# Altium schematic sheet 智能车驱动板DRV8701E.SchDoc
size A4; SheetNumber: 1; SheetTotal: 1
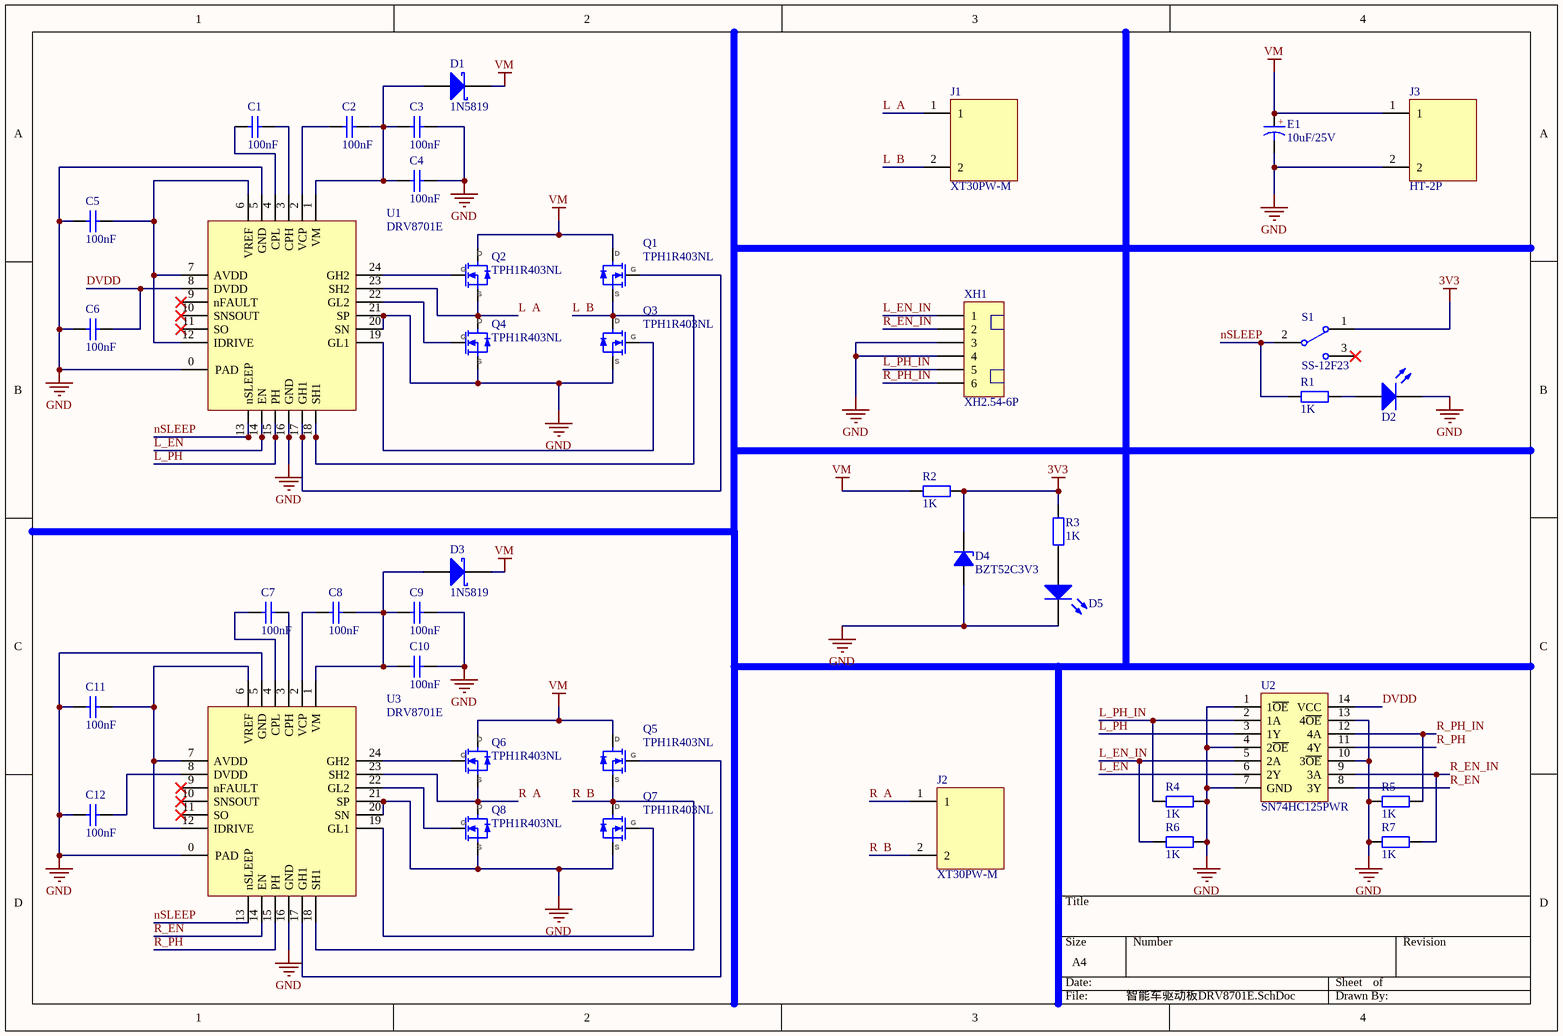
[diagram p0: 智能车驱动板DRV8701E.SchDoc]

## Parts
C1  100nF  [C0603_L]
C2  100nF  [C0603_L]
C3  100nF  [C0603_L]
C4  100nF  [C0603_L]
C5  100nF  [C0603_L]
C6  100nF  [C0603_L]
C7  100nF  [C0603_L]
C8  100nF  [C0603_L]
C9  100nF  [C0603_L]
C10  100nF  [C0603_L]
C11  100nF  [C0603_L]
C12  100nF  [C0603_L]
D1  1N5819  [SOD-323]
D2  LED  [LED-0603_R]  (value not drawn)
D3  1N5819  [SOD-323]
D4  BZT52C3V3  [SOD-123-L]
D5  LED  [LED-0603_R]  (value not drawn)
E1  10uF/25V  [CT-2.0*5*8-R]
J1  XT30PW-M  [XT30-WI]
J2  XT30PW-M  [XT30-WI]
J3  HT-2P  [CZ-5.08-L-Z-2P]
Q1  TPH1R403NL  [DFN5x6]
Q2  TPH1R403NL  [DFN5x6]
Q3  TPH1R403NL  [DFN5x6]
Q4  TPH1R403NL  [DFN5x6]
Q5  TPH1R403NL  [DFN5x6]
Q6  TPH1R403NL  [DFN5x6]
Q7  TPH1R403NL  [DFN5x6]
Q8  TPH1R403NL  [DFN5x6]
R1  1K  [R0603_L]
R2  1K  [R0603_L]
R3  1K  [R0603_L]
R4  1K  [R0603_L]
R5  1K  [R0603_L]
R6  1K  [R0603_L]
R7  1K  [R0603_L]
S1  SS-12F23  [MSK-12C01-07]
U1  DRV8701E  [QFN24-4x4]
U2  SN74HC125PWR  [TSSOP14]
U3  DRV8701E  [QFN24-4x4]
XH1  XH2.54-6P  [XH2.54-6P-WI]

## Nets
3V3: D4.K R2.2 R3.2 S1.1
GND: C3.2 C4.2 C5.1 C6.1 C9.2 C10.2 C11.1 C12.1 D2.2(K) D4.A D5.2(K) E1.2 J3.2 Q3.3(S) Q4.3(S) Q7.3(S) Q8.3(S) R4.2 R5.1 R6.2 R7.1 U1.0(PAD) U1.5(GND) U1.16(GND) U1.20(SN) U1.21(SP) U2.1(1~{OE}) U2.4(2~{OE}) U2.7(GND) U2.10(3~{OE}) U2.13(4~{OE}) U3.0(PAD) U3.5(GND) U3.16(GND) U3.20(SN) U3.21(SP) XH1.3 XH1.4
VM: D1.2(K) D3.2(K) E1.1 J3.1 Q1.1(D) Q2.1(D) Q5.1(D) Q6.1(D) R2.1
DVDD: C6.2 U1.8(DVDD) U2.14(VCC)
L  A: J1.1 Q2.3(S) Q4.1(D) U1.23(SH2)
L  B: J1.2 Q1.3(S) Q3.1(D) U1.18(SH1)
L_EN: U1.14(EN) U2.6(2Y)
L_EN_IN: R6.1 U2.5(2A) XH1.1
L_PH: U1.15(PH) U2.3(1Y)
L_PH_IN: R4.1 U2.2(1A) XH1.5
nSLEEP: R1.1 S1.2 U1.13(nSLEEP) U3.13(nSLEEP)
R  A: J2.1 Q6.3(S) Q8.1(D) U3.23(SH2)
R  B: J2.2 Q5.3(S) Q7.1(D) U3.18(SH1)
R_EN: U2.8(3Y) U3.14(EN)
R_EN_IN: R7.2 U2.9(3A) XH1.2
R_PH: U2.11(4Y) U3.15(PH)
R_PH_IN: R5.2 U2.12(4A) XH1.6
NetC1_1: C1.1 U1.4(CPL)
NetC1_2: C1.2 U1.3(CPH)
NetC2_1: C2.1 U1.2(VCP)
NetC2_2: C2.2 C3.1 C4.1 D1.1(A) U1.1(VM)
NetC5_2: C5.2 U1.6(VREF) U1.7(AVDD) U1.12(IDRIVE)
NetC7_1: C7.1 U3.4(CPL)
NetC7_2: C7.2 U3.3(CPH)
NetC8_1: C8.1 U3.2(VCP)
NetC8_2: C8.2 C9.1 C10.1 D3.1(A) U3.1(VM)
NetC11_2: C11.2 U3.6(VREF) U3.7(AVDD) U3.12(IDRIVE)
NetC12_2: C12.2 U3.8(DVDD)
NetD2_1: D2.1(A) R1.2
NetD5_1: D5.1(A) R3.1
NetQ1_2: Q1.2(G) U1.17(GH1)
NetQ2_2: Q2.2(G) U1.24(GH2)
NetQ3_2: Q3.2(G) U1.19(GL1)
NetQ4_2: Q4.2(G) U1.22(GL2)
NetQ5_2: Q5.2(G) U3.17(GH1)
NetQ6_2: Q6.2(G) U3.24(GH2)
NetQ7_2: Q7.2(G) U3.19(GL1)
NetQ8_2: Q8.2(G) U3.22(GL2)

Not connected (* = marked no-connect by the designer): S1 3*; U1 9(nFAULT)* 10(SNSOUT)* 11(SO)*; U3 9(nFAULT)* 10(SNSOUT)* 11(SO)*

## Notes on the sheet
- (in symbol C-CS) +

## Library data of the parts
C1-C12 = C-SMD: 贴片电容; BOM名称: 无极性贴片电容
D1 D3 = 1N5819: 肖特基二极管; BOM名称: 肖特基二极管
D2 D5 = LED_SMD: 贴片发光二极管
D4 = Diode Zen: 3.3V稳压二极管; Published: 8-Jun-2000; Revision: July-2002: Re-released for DXP Platform.; Publisher: Altium Limited; Price(RMB): 0.000
E1 = C-CS: 直插固态电容; BOM名称: 直插固态电容
J1-J3 = XT30PW-M: 30A Low Temperature Rise Fire Retardant Plug; Manufacturer_Name: Amass; Geometry.Height: 5mm; Manufacturer_Part_Number: XT30PW-M; Mouser Part Number: *; Mouser Price/Stock: *; Arrow Part Number: *; Arrow Price/Stock: *; Datasheet Link: https://www.tme.eu/sl/Document/ce4077e36b79046da520ca73227e15de/XT30PW%20SPEC.pdf
Q1-Q8 = TPH1R403NL: N沟道MOS
R1-R7 = R-SMD: 贴片电阻; BOM名称: 贴片电阻
S1 = SSW-1P: 1路波动开关; BOM名称: 波动开关
U1 U3 = DRV8701E: DRV8701E Ti全桥驱动芯片
U2 = SN74HC125PWR: 三态输出的四路缓冲器